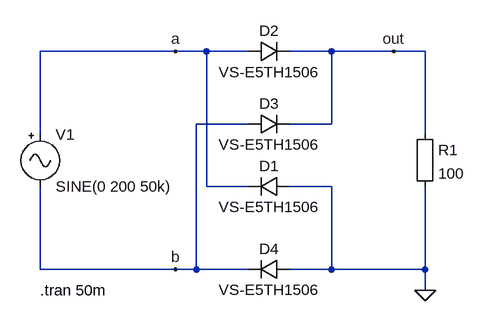
[diagram p0: schematic Diode-Rectifier-8.asc]
Diode-Rectifier-8.asc, the LTspice schematic file:
Version 4
SHEET 1 880 680
WIRE 64 -240 -144 -240
WIRE 112 -240 64 -240
WIRE 176 -240 112 -240
WIRE 304 -240 240 -240
WIRE 400 -240 304 -240
WIRE 448 -240 400 -240
WIRE 176 -128 96 -128
WIRE 304 -128 304 -240
WIRE 304 -128 240 -128
WIRE -144 -112 -144 -240
WIRE 448 -112 448 -240
WIRE 112 -32 112 -240
WIRE 176 -32 112 -32
WIRE 304 -32 240 -32
WIRE -144 96 -144 -32
WIRE 64 96 -144 96
WIRE 96 96 96 -128
WIRE 96 96 64 96
WIRE 176 96 96 96
WIRE 304 96 304 -32
WIRE 304 96 240 96
WIRE 448 96 448 -32
WIRE 448 96 304 96
WIRE 448 128 448 96
FLAG 448 128 0
FLAG 64 -240 a
FLAG 400 -240 out
FLAG 64 96 b
SYMBOL diode 240 -48 R90
WINDOW 0 0 32 VBottom 2
WINDOW 3 32 32 VTop 2
SYMATTR InstName D1
SYMATTR Value VS-E5TH1506
SYMBOL Misc\\EuropeanResistor 432 -128 R0
SYMATTR InstName R1
SYMATTR Value 100
SYMBOL Misc\\signal -144 -128 R0
WINDOW 123 0 0 Left 2
SYMATTR SpiceLine Rser=0.5
SYMATTR InstName V1
SYMATTR Value SINE(0 200 50k)
SYMBOL diode 176 -224 R270
WINDOW 0 32 32 VTop 2
WINDOW 3 0 32 VBottom 2
SYMATTR InstName D2
SYMATTR Value VS-E5TH1506
SYMBOL diode 176 -112 R270
WINDOW 0 32 32 VTop 2
WINDOW 3 0 32 VBottom 2
SYMATTR InstName D3
SYMATTR Value VS-E5TH1506
SYMBOL diode 240 80 R90
WINDOW 0 0 32 VBottom 2
WINDOW 3 32 32 VTop 2
SYMATTR InstName D4
SYMATTR Value VS-E5TH1506
TEXT -144 128 Left 2 !.tran 50m

The netlist it stands for:
* Diode-Rectifier-8.asc
D1 0 a VS-E5TH1506
R1 out 0 100
V1 a b SINE(0 200 50k) Rser=0.5
D2 a out VS-E5TH1506
D3 b out VS-E5TH1506
D4 0 b VS-E5TH1506
.model D D
.lib standard.dio
.tran 50m
.backanno
.end